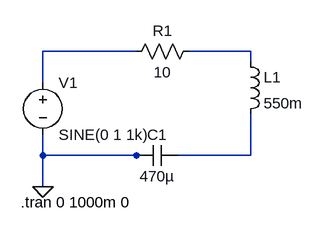
[diagram p0: schematic rlcbasic.asc]
rlcbasic.asc, the LTspice schematic file:
Version 4
SHEET 1 880 680
WIRE 144 96 0 96
WIRE 320 96 224 96
WIRE 320 112 320 96
WIRE 0 144 0 96
WIRE 0 256 0 224
WIRE 144 256 0 256
WIRE 160 256 144 256
WIRE 320 256 320 192
WIRE 320 256 208 256
WIRE 0 304 0 256
FLAG 0 304 0
SYMBOL res 240 80 R90
WINDOW 0 0 56 VBottom 2
WINDOW 3 32 56 VTop 2
SYMATTR InstName R1
SYMATTR Value 10
SYMBOL ind 304 96 R0
SYMATTR InstName L1
SYMATTR Value 550m
SYMBOL cap 208 240 R90
WINDOW 0 0 32 VBottom 2
WINDOW 3 32 32 VTop 2
SYMATTR InstName C1
SYMATTR Value 470µ
SYMBOL voltage 0 128 R0
WINDOW 123 0 0 Left 0
WINDOW 39 0 0 Left 0
SYMATTR InstName V1
SYMATTR Value SINE(0 1 1k)
TEXT -34 328 Left 2 !.tran 0 1000m 0

The netlist it stands for:
* rlcbasic.asc
R1 N002 N001 10
L1 N002 N003 550m
C1 N003 0 470µ
V1 N001 0 SINE(0 1 1k)
.tran 0 1000m 0
.backanno
.end